# EAGLE schematic mosfet_smt_test (EAGLE 9.6.2)
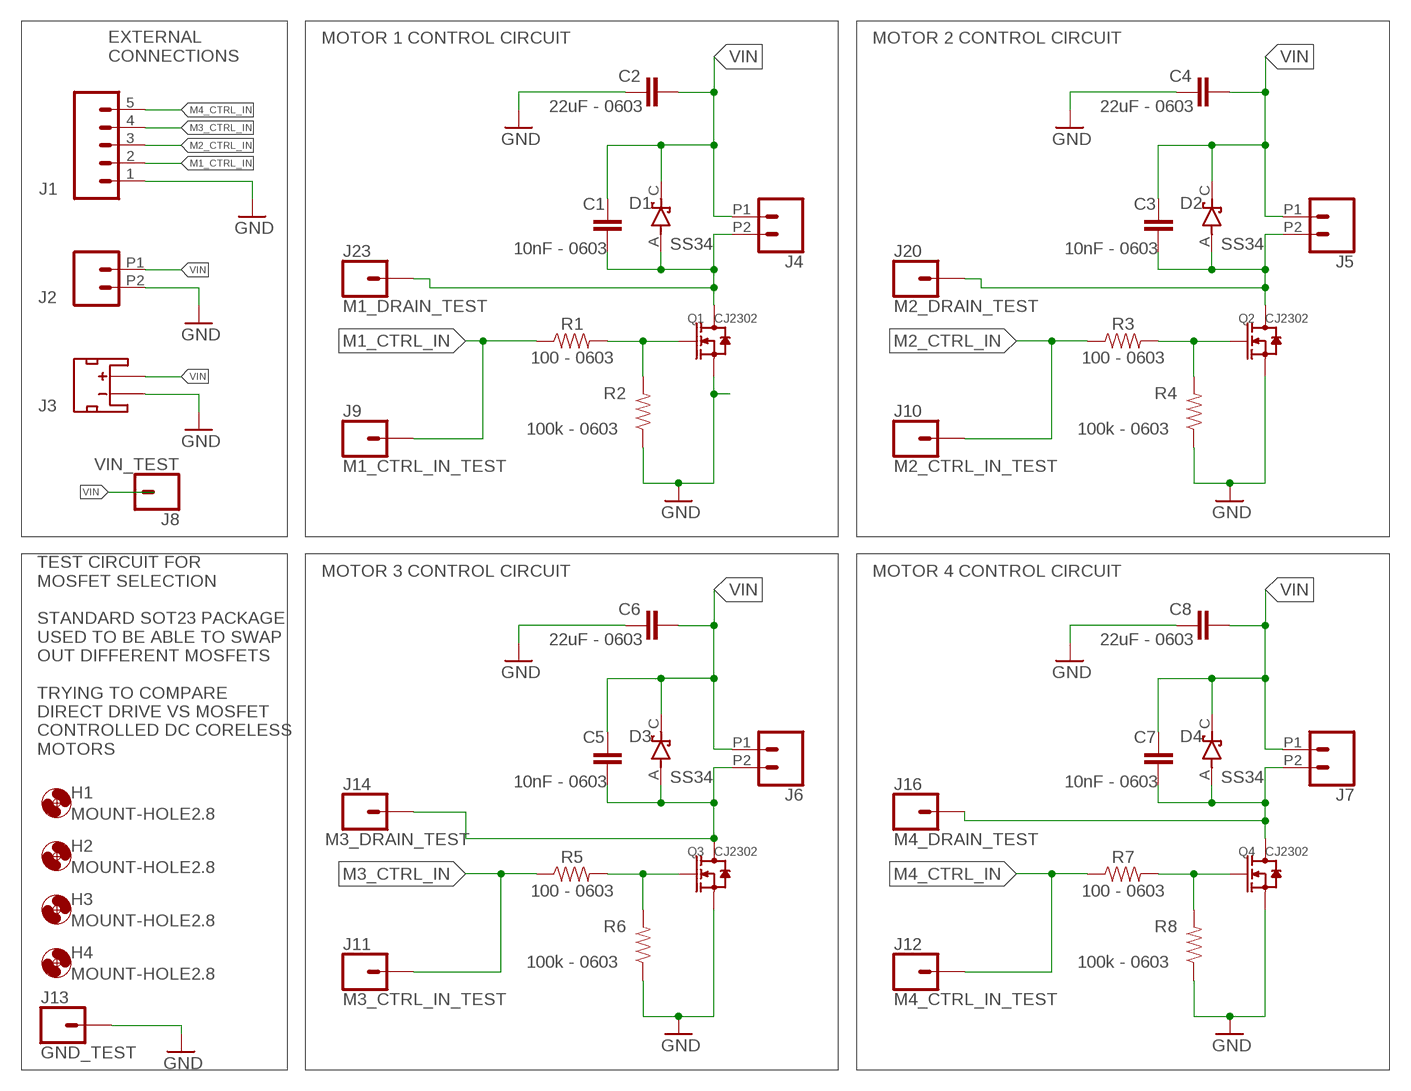
[diagram p0: schematic, sheet 1]

## Parts
C1  10nF - 0603  CC0603CRNPO9BN1R0  [CAP_0603]
C2  22uF - 0603  CC0603CRNPO9BN1R0  [CAP_0603]
C3  10nF - 0603  CC0603CRNPO9BN1R0  [CAP_0603]
C4  22uF - 0603  CC0603CRNPO9BN1R0  [CAP_0603]
C5  10nF - 0603  CC0603CRNPO9BN1R0  [CAP_0603]
C6  22uF - 0603  CC0603CRNPO9BN1R0  [CAP_0603]
C7  10nF - 0603  CC0603CRNPO9BN1R0  [CAP_0603]
C8  22uF - 0603  CC0603CRNPO9BN1R0  [CAP_0603]
D1  SS34  [DIOM7959X265N]
D2  SS34  [DIOM7959X265N]
D3  SS34  [DIOM7959X265N]
D4  SS34  [DIOM7959X265N]
H1  MOUNT-HOLE2.8  [2,8]
H2  MOUNT-HOLE2.8  [2,8]
H3  MOUNT-HOLE2.8  [2,8]
H4  MOUNT-HOLE2.8  [2,8]
J1  CONN_05  [1X05]
J2  CONN_022.54MM_SCREWTERM  [1X02_2.54_SCREWTERM]
J3  JST_2MM_MALE  [JST-2-SMD]
J4  CONN_022.54MM_SCREWTERM  [1X02_2.54_SCREWTERM]
J5  CONN_022.54MM_SCREWTERM  [1X02_2.54_SCREWTERM]
J6  CONN_022.54MM_SCREWTERM  [1X02_2.54_SCREWTERM]
J7  CONN_022.54MM_SCREWTERM  [1X02_2.54_SCREWTERM]
J8  VIN_TEST  CONN_01  [1X01]
J9  M1_CTRL_IN_TEST  CONN_01  [1X01]
J10  M2_CTRL_IN_TEST  CONN_01  [1X01]
J11  M3_CTRL_IN_TEST  CONN_01  [1X01]
J12  M4_CTRL_IN_TEST  CONN_01  [1X01]
J13  GND_TEST  CONN_01  [1X01]
J14  M3_DRAIN_TEST  CONN_01  [1X01]
J16  M4_DRAIN_TEST  CONN_01  [1X01]
J20  M2_DRAIN_TEST  CONN_01  [1X01]
J23  M1_DRAIN_TEST  CONN_01  [1X01]
Q1  CJ2302  SMD-MOSFET-N-CH-20V-2.1A-CJ2302(SOT-23)  [SOT-23]
Q2  CJ2302  SMD-MOSFET-N-CH-20V-2.1A-CJ2302(SOT-23)  [SOT-23]
Q3  CJ2302  SMD-MOSFET-N-CH-20V-2.1A-CJ2302(SOT-23)  [SOT-23]
Q4  CJ2302  SMD-MOSFET-N-CH-20V-2.1A-CJ2302(SOT-23)  [SOT-23]
R1  100 - 0603  0OHM-0603-1/10W-5%  [0603]
R2  100k - 0603  0OHM-0603-1/10W-5%  [0603]
R3  100 - 0603  0OHM-0603-1/10W-5%  [0603]
R4  100k - 0603  0OHM-0603-1/10W-5%  [0603]
R5  100 - 0603  0OHM-0603-1/10W-5%  [0603]
R6  100k - 0603  0OHM-0603-1/10W-5%  [0603]
R7  100 - 0603  0OHM-0603-1/10W-5%  [0603]
R8  100k - 0603  0OHM-0603-1/10W-5%  [0603]

## Nets
GND: C2.2 C4.2 C6.2 C8.2 J1.1 J2.P2 J3.1(-) J13.1 Q1.2(S) Q2.2(S) Q3.2(S) Q4.2(S) R2.1 R4.1 R6.1 R8.1
M1_CTRL_IN: J1.2 J9.1 R1.1
M2_CTRL_IN: J1.3 J10.1 R3.1
M3_CTRL_IN: J1.4 J11.1 R5.1
M4_CTRL_IN: J1.5 J12.1 R7.1
N$1: Q1.1(G) R1.2 R2.2
N$2: C1.2 D1.A J4.P2 J23.1 Q1.3(D)
N$3: Q2.1(G) R3.2 R4.2
N$4: C3.2 D2.A J5.P2 J20.1 Q2.3(D)
N$5: Q3.1(G) R5.2 R6.2
N$6: C5.2 D3.A J6.P2 J14.1 Q3.3(D)
N$7: Q4.1(G) R7.2 R8.2
N$8: C7.2 D4.A J7.P2 J16.1 Q4.3(D)
VIN: C1.1 C2.1 C3.1 C4.1 C5.1 C6.1 C7.1 C8.1 D1.C(K) D2.C(K) D3.C(K) D4.C(K) J2.P1 J3.2(+) J4.P1 J5.P1 J6.P1 J7.P1 J8.1
Unconnected: J3.NC1(PAD1) J3.NC2(PAD2)

## Notes on the sheet
- MOTOR 1 CONTROL CIRCUIT | MOTOR 2 CONTROL CIRCUIT
- EXTERNAL
  CONNECTIONS
- MOTOR 3 CONTROL CIRCUIT | MOTOR 4 CONTROL CIRCUIT
- TEST CIRCUIT FOR
  MOSFET SELECTION
  
  STANDARD SOT23 PACKAGE
  USED TO BE ABLE TO SWAP
  OUT DIFFERENT MOSFETS
  
  TRYING TO COMPARE
  DIRECT DRIVE VS MOSFET
  CONTROLLED DC CORELESS
  MOTORS

## Library data of the parts
C1-C8 = Resistor_Capacitor:CC0603CRNPO9BN1R0: CAP CER 1PF 50V C0G/NPO 0603 Manufacturer's datasheet <http://www.yageo.com/documents/recent/UPY-GP_NP0_16V-to-50V_16.pdf>; CREATED_BY: PCBLayout.com; DIGIKEY_PART_NUMBER: 311-1049-2-ND; MANUFACTURER: Yageo; MPN: CC0603CRNPO9BN1R0; PACKAGE: SMD 0603
D1-D4 = SS34:SS34: Diode Schottky 40V 3A 2-Pin SMC T/R Check prices <https://pricing.snapeda.com/parts/SS34/ON%20Semiconductor/view-part?ref=eda>; AVAILABILITY: Good; DESCRIPTION: Diode Schottky 40V 3A Surface Mount SMC (DO-214AB); MF: ON Semiconductor; MP: SS34; PACKAGE: SMC-2 ON Semiconductor; PRICE: None; PURCHASE-URL: https://pricing.snapeda.com/search/part/SS34/?ref=eda
H1-H4 = holes:MOUNT-HOLE: MOUNTING HOLE with drill center marker
J1 = SparkFun-Connectors:CONN_05: Multi connection point. Often used as Generic Header-pin footprint for 0.1 inch spaced/style header connections On any of the 0.1 inch spaced packages, you can populate with these: Break Away Headers - Straight <https://www.sparkfun.com/products/116> (PRT-00116) Break Away Male Headers - Right Angle <https://www.sparkfun.com/products/553> (PRT-00553) Female Headers <https://www.sparkfun.com/products/115> (PRT-00115) Break Away Headers - Machine Pin <https://www.sparkfun.com/products/117> (PRT-00117) Break Away Female Headers - Swiss Machine Pin <https://www.sparkfun.com/products/743> (PRT-00743) For SCREWTERMINALS and SPRING TERMINALS visit here: Screw Terimnals on SparkFun.com <https://www.sparkfun.com/search/results?term=Screw+Terminals> (5mm/3.5mm/2.54mm spacing) This device is also useful as a general connection point to wire up your design to another part of your project. Our various solder wires solder well into these plated through hole pads. Hook-Up Wire - Assortment (Stranded, 22 AWG) <https://www.sparkfun.com/products/11375> (PRT-11375) Hook-Up Wire - Assortment (Solid Core, 22 AWG) <https://www.sparkfun.com/products/11367> (PRT-11367) View the entire wire category on our website here <https://www.sparkfun.com/categories/141> Special notes: Molex polarized connector foot print use with SKU : PRT-08231 with associated crimp pins and housings. 1MM SMD Version SKU: PRT-10208
J2 J4-J7 = SparkFun-Connectors:CONN_02: Multi connection point. Often used as Generic Header-pin footprint for 0.1 inch spaced/style header connections On any of the 0.1 inch spaced packages, you can populate with these: Break Away Headers - Straight <https://www.sparkfun.com/products/116> (PRT-00116) Break Away Male Headers - Right Angle <https://www.sparkfun.com/products/553> (PRT-00553) Female Headers <https://www.sparkfun.com/products/115> (PRT-00115) Break Away Headers - Machine Pin <https://www.sparkfun.com/products/117> (PRT-00117) Break Away Female Headers - Swiss Machine Pin <https://www.sparkfun.com/products/743> (PRT-00743) For SCREWTERMINALS and SPRING TERMINALS visit here: Screw Terimnals on SparkFun.com <https://www.sparkfun.com/search/results?term=Screw+Terminals> (5mm/3.5mm/2.54mm spacing) This device is also useful as a general connection point to wire up your design to another part of your project. Our various solder wires solder well into these plated through hole pads. Hook-Up Wire - Assortment (Stranded, 22 AWG) <https://www.sparkfun.com/products/11375> (PRT-11375) Hook-Up Wire - Assortment (Solid Core, 22 AWG) <https://www.sparkfun.com/products/11367> (PRT-11367) View the entire wire category on our website here <https://www.sparkfun.com/categories/141> Special notes: Molex polarized connector foot print use with: PRT-08233 with associated crimp pins and housings. 2.54_SCREWTERM for use with PRT-10571. 3.5mm Screw Terminal footprints for PRT-08084 5mm Screw Terminal footprints for use with PRT-08432
J3 = SparkFun-Connectors:JST_2MM_MALE: JST 2MM MALE RA CONNECTOR Two pin, compact surface mount connector. Commonly used as a battery input connection point. We really like the solid locking feeling and high current rating on these small connectors. We use these all the time as battery connectors. Mates to single-cell LiPo batteries. Here is the connector we sell at SparkFun: JST Right Angle Connector - White <https://www.sparkfun.com/products/8612> (PRT-08612) Datasheet <http://www.sparkfun.com/datasheets/Prototyping/Connectors/JST-Horizontal.pdf> It was used on these SparkFun products: SparkFun MOSFET Power Controller <https://www.sparkfun.com/products/11214> (PRT-11214) SparkFun Battery Babysitter - LiPo Battery Manager <https://www.sparkfun.com/products/13777> (PRT-13777) And many, many others that required a lipo battery connection.; PROD_ID: CONN-11443; SF_ID: PRT-08612
J8-J14 J16 J20 J23 = SparkFun-Connectors:CONN_01: Single connection point. Often used as Generic Header-pin footprint for 0.1 inch spaced/style header connections On any of the 0.1 inch spaced packages, you can populate with these: Break Away Headers - Straight <https://www.sparkfun.com/products/116> (PRT-00116) Break Away Male Headers - Right Angle <https://www.sparkfun.com/products/553> (PRT-00553) Female Headers <https://www.sparkfun.com/products/115> (PRT-00115) Break Away Headers - Machine Pin <https://www.sparkfun.com/products/117> (PRT-00117) Break Away Female Headers - Swiss Machine Pin <https://www.sparkfun.com/products/743> (PRT-00743) This device is also useful as a general connection point to wire up your design to another part of your project. Our various solder wires solder well into these plated through hole pads. Hook-Up Wire - Assortment (Stranded, 22 AWG) <https://www.sparkfun.com/products/11375> (PRT-11375) Hook-Up Wire - Assortment (Solid Core, 22 AWG) <https://www.sparkfun.com/products/11367> (PRT-11367) View the entire wire category on our website here <https://www.sparkfun.com/categories/141> Special notes: SMTSO-256-ET is a "flush mount" nut for a 4-40 screw. We mostly use this on specialty testbeds; it is a nice way to connect hardware to your PCB at an adjustable hieght. Also note, the SNAP packages are for using a snappable style connector. We sell a baggie of snaps and they are also used on two LilyPad designs: Snap Assortment - 30 pack (male and female) <https://www.sparkfun.com/products/11347> (DEV-11347) LilyPad Arduino SimpleSnap <https://www.sparkfun.com/products/10941> (DEV-10941) LilyPad SimpleSnap Protoboard <https://www.sparkfun.com/products/10940> (DEV-10940)
Q1-Q4 = OPL_Discrete_Semiconductor:SMD-MOSFET-N-CH-20V-2.1A-CJ2302(SOT-23): 305030015; MPN: CJ2302
R1-R8 = SparkFun-Resistors:0OHM: 0Ω resistor A resistor is a passive two-terminal electrical component that implements electrical resistance as a circuit element. Resistors act to reduce current flow, and, at the same time, act to lower voltage levels within circuits. - Wikipedia; PROD_ID: RES-08609; VALUE: 0